# EAGLE schematic shield_scaffold (EAGLE 6.3)
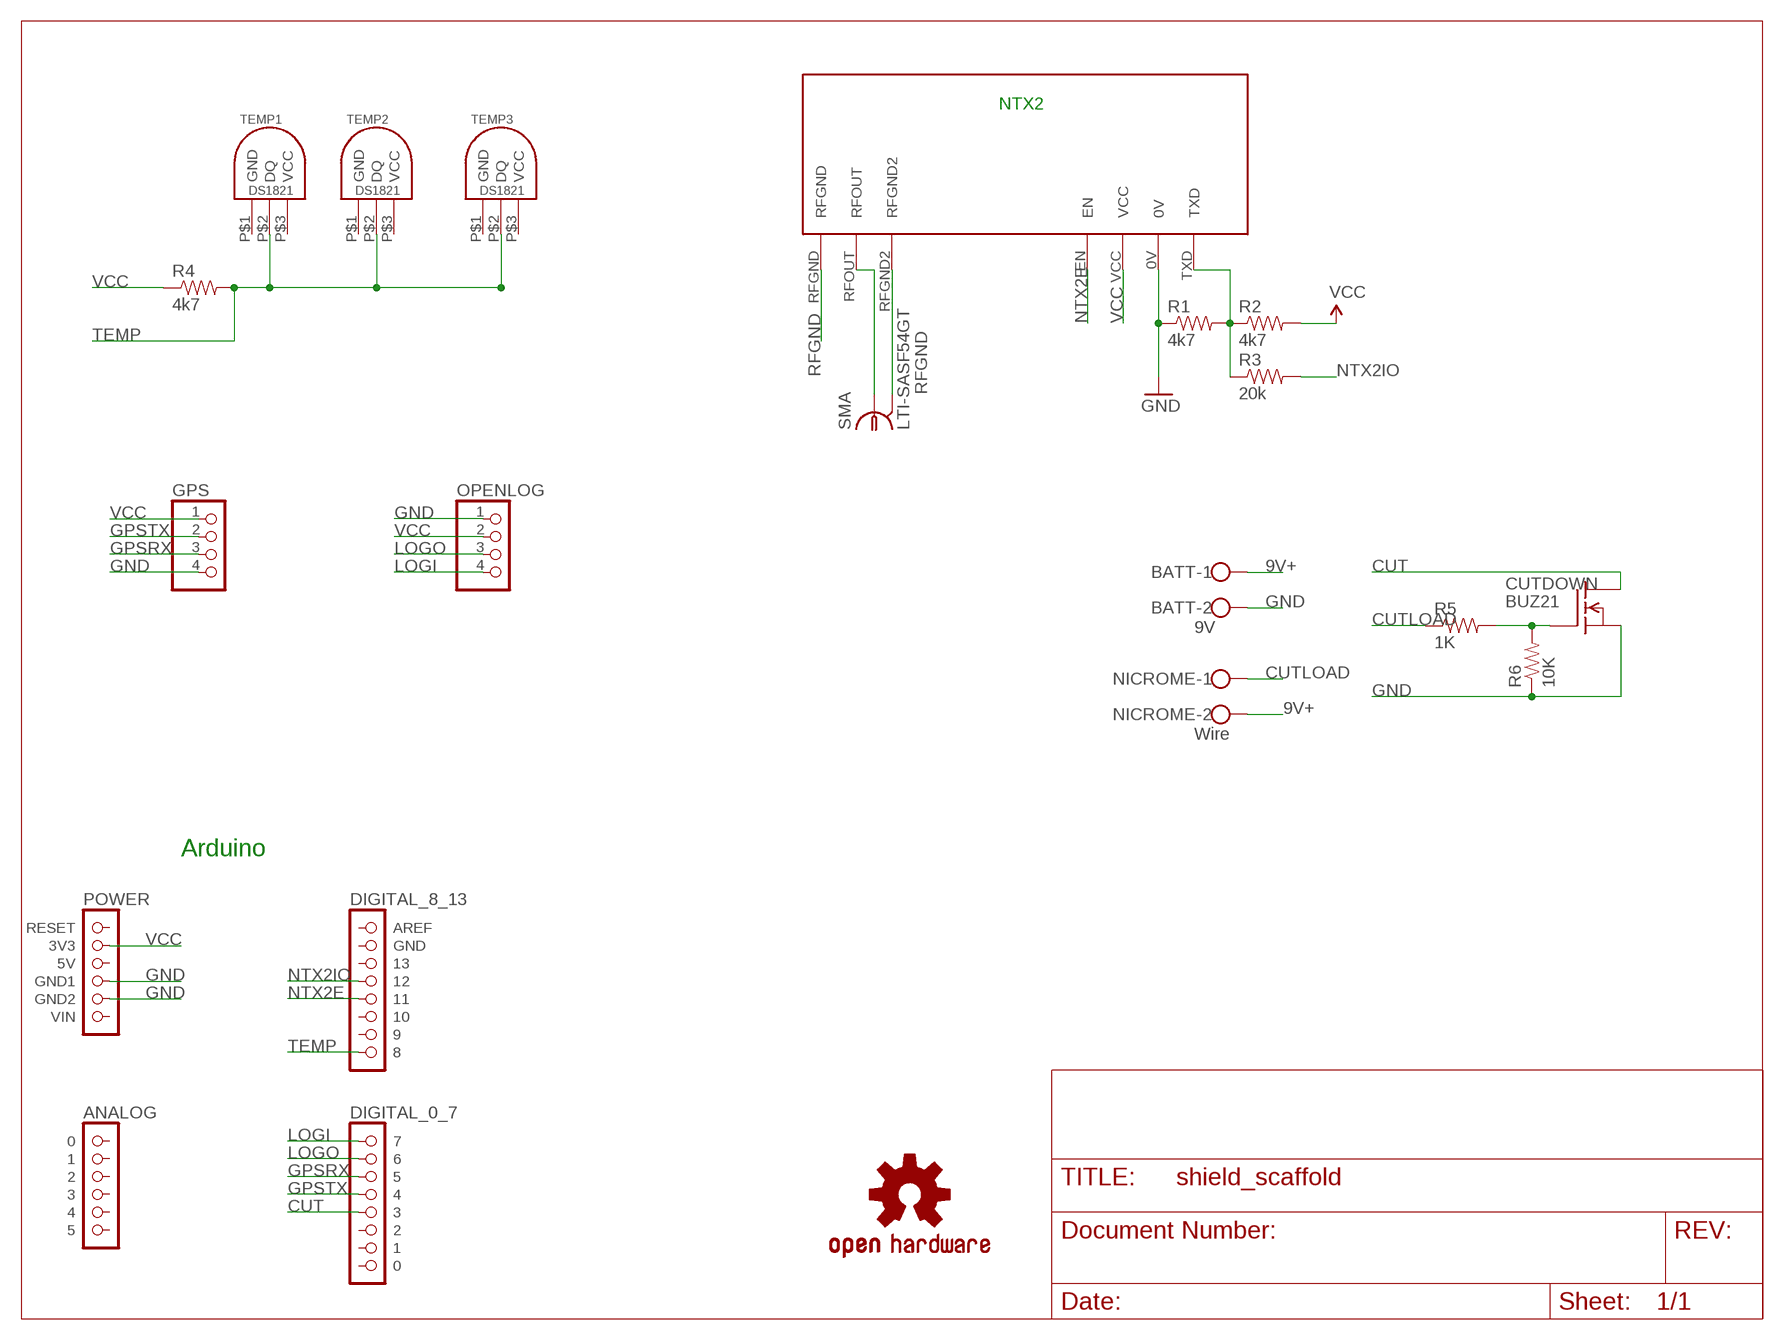
[diagram p0: schematic, sheet 1]

## Parts
BATT  9V  W237-102  [W237-102]
CUTDOWN  BUZ21  [TO220]
GPS  PINHD-1X4  [1X04]
NICROME  Wire  W237-102  [W237-102]
OPENLOG  PINHD-1X4  [1X04]
R1  4k7  RESISTORPTH-1/4W  [AXIAL-0.4]
R2  4k7  RESISTORPTH-1/4W  [AXIAL-0.4]
R3  20k  RESISTORPTH-1/4W  [AXIAL-0.4]
R4  4k7  RESISTORPTH-1/4W  [AXIAL-0.4]
R5  1K  RESISTORPTH-1/4W  [AXIAL-0.4]
R6  10K  RESISTORPTH-1/4W  [AXIAL-0.4]
SMA  LTI-SASF54GT  [LTI-SASF54GT]
TEMP1  DS1821  [DS1821]
TEMP2  DS1821  [DS1821]
TEMP3  DS1821  [DS1821]
U$1  POWER  [1X06]
U$2  ANALOG  [1X06]
U$3  DIGITAL_0_7  [1X08]
U$4  DIGITAL_8_13  [1X08]
U$5  NTX2  [NTX2]
U$6  OSHW-LOGOM  [OSHW-LOGO-M]

## Nets
9V+: BATT.1 NICROME.2
CUT: CUTDOWN.2(D) U$3.5
CUTLOAD: NICROME.1 R5.P$1
GND: BATT.2 CUTDOWN.3(S) GPS.4 OPENLOG.1 R1.P$1 R6.P$1 U$1.4(GND1) U$1.5(GND2) U$5.0V
GPSRX: GPS.3 U$3.3
GPSTX: GPS.2 U$3.4
LOGI: OPENLOG.4 U$3.1
LOGO: OPENLOG.3 U$3.2
N$2: CUTDOWN.1(G) R5.P$2 R6.P$2
NTX2E: U$4.5 U$5.EN
NTX2IO: R3.P$2 U$4.4
RFGND: SMA.2(GND) U$5.RFGND U$5.RFGND2
RFOUT: SMA.1 U$5.RFOUT
TEMP: R4.P$2 TEMP1.P$2(DQ) TEMP2.P$2(DQ) TEMP3.P$2(DQ) U$4.8
TXD: R1.P$2 R2.P$1 R3.P$1 U$5.TXD
VCC: GPS.1 OPENLOG.2 R2.P$2 R4.P$1 U$1.2(3V3) U$5.VCC
Unconnected: U$1.1(RESET) U$1.3(5V) U$1.6(VIN) U$2.1 U$2.2 U$2.3 U$2.4 U$2.5 U$2.6 U$3.6 U$3.7 U$3.8 U$4.1(AREF) U$4.2(GND) U$4.3 U$4.6 U$4.7

## Notes on the sheet
- NTX2
- Arduino

## Power pins joined to a net without a drawn wire
GND: SMA.3(GND) SMA.4(GND) SMA.5(GND) TEMP1.P$1(GND) TEMP2.P$1(GND) TEMP3.P$1(GND)
VCC: TEMP1.P$3(VCC) TEMP2.P$3(VCC) TEMP3.P$3(VCC)

## Library data of the parts
BATT NICROME = con-wago-500:W237-102: WAGO SCREW CLAMP; MPN: 237-102; OC_FARNELL: unknown; OC_NEWARK: 70K9898
CUTDOWN = transistor-fet:BUZ21: N-Channel Enhancement MOSFET 100V; 19A; 0,1Ohm
GPS OPENLOG = pinhead:PINHD-1X4: PIN HEADER
R1-R6 = SparkFun-Resistors:RESISTOR: Resistor Basic schematic elements and footprints for 0603, 1206, and PTH resistors.
SMA = con-coax:LTI-SASF54GT: SMA vertical PCB thrue hole jack Source: Lighthorse Technologies, inc. SASF54GT.pdf; OC_FARNELL: unknown; OC_NEWARK: unknown
TEMP1-TEMP3 = Icarus:DS1821: Dallas Semiconductor Temp Sensor
U$1 = arduino:POWER
U$2 = arduino:ANALOG
U$3 = arduino:DIGITAL_0_7
U$4 = arduino:DIGITAL_8_13
U$5 = Ava:NTX2: Radiometrix NTX2 Transmitter Module Author Anthony Stirk / http://ava.upuaut.net
U$6 = SparkFun-Aesthetics:OSHW-LOGO: Open Source Hardware Logo This logo indicates the piece of hardware it is found on incorporates a OSHW license and/or adheres to the definition of open source hardware found here: http://freedomdefined.org/OSHW